# EAGLE design Onion_O2S_mPCIe (EAGLE 9.6.2)
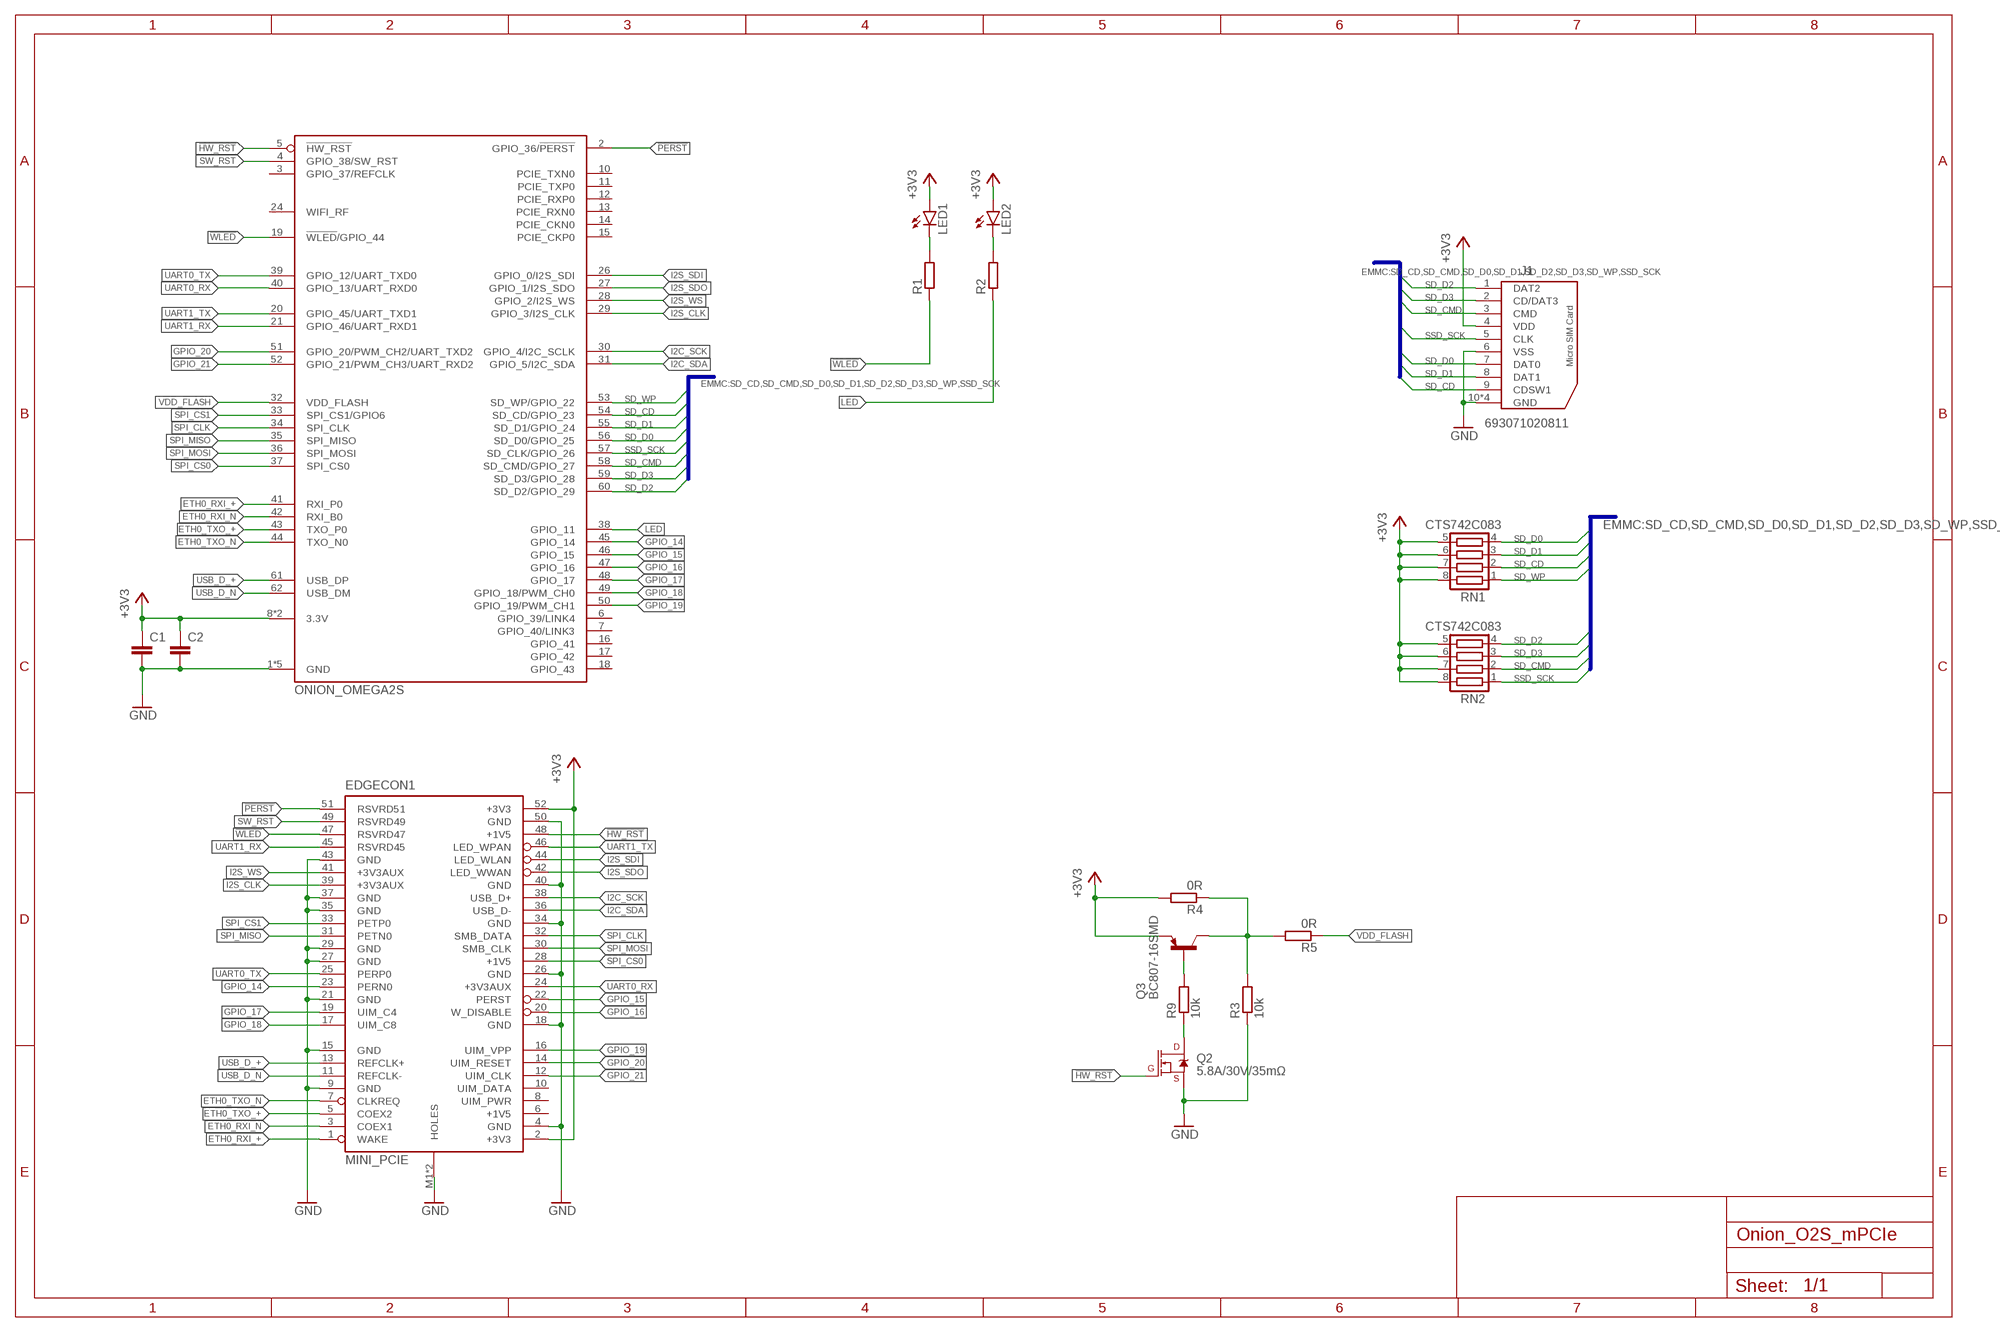
[diagram p0: schematic, sheet 1]

## Parts
C1  C-EUC0603  [C0603]
C2  C-EUC0603  [C0603]
EDGECON1  MINI_PCIE  [MINI_PCIE]
J1  693071020811  [693071020811]
LED1  LEDCHIPLED_0603  [CHIPLED_0603]
LED2  LEDCHIPLED_0603  [CHIPLED_0603]
Q2  5.8A/30V/35mΩ  MOSFET-NCH-AO3404A  [SOT23-3]
Q3  BC807-16SMD  [SOT23-BEC]
R1  R-EU_R0603  [R0603]
R2  R-EU_R0603  [R0603]
R3  10k  R-EU_R0603  [R0603]
R4  0R  R-EU_R0603  [R0603]
R5  0R  R-EU_R0603  [R0603]
R9  10k  R-EU_R0603  [R0603]
RN1  CTS742C083  [CTS742C083]
RN2  CTS742C083  [CTS742C083]
U1  ONION_OMEGA2S  [ONION_OMEGA2S]

## Nets
!HW_RST: EDGECON1.48(+1V5) Q2.1(G) U1.5(!HW_RST)
!PERST: EDGECON1.51(RSVRD51) U1.2(GPIO_36/!PERST)
!WLED: EDGECON1.47(RSVRD47) R1.1 U1.19(!WLED!/GPIO_44)
+3V3: C1.1 C2.1 EDGECON1.2(+3V3) EDGECON1.52(+3V3) J1.4(VDD) LED1.A LED2.A Q3.E R4.2 RN1.5 RN1.6 RN1.7 RN1.8 RN2.5 RN2.6 RN2.7 RN2.8 U1.8(3.3V) U1.9(3.3V)
ETH0_RXI_+ [LAN_100R]: EDGECON1.1(WAKE) U1.41(RXI_P0)
ETH0_RXI_N [LAN_100R]: EDGECON1.3(COEX1) U1.42(RXI_B0)
ETH0_TXO_+ [LAN_100R]: EDGECON1.5(COEX2) U1.43(TXO_P0)
ETH0_TXO_N [LAN_100R]: EDGECON1.7(CLKREQ) U1.44(TXO_N0)
GND: C1.2 C2.2 EDGECON1.4(GND) EDGECON1.9(GND) EDGECON1.15(GND) EDGECON1.18(GND) EDGECON1.21(GND) EDGECON1.26(GND) EDGECON1.27(GND) EDGECON1.29(GND) EDGECON1.34(GND) EDGECON1.35(GND) EDGECON1.37(GND) EDGECON1.40(GND) EDGECON1.43(GND) EDGECON1.50(GND) EDGECON1.M1(HOLES) EDGECON1.M2(HOLES) J1.6(VSS) J1.10(GND) J1.11(GND) J1.12(GND) J1.13(GND) Q2.2(S) R3.1 U1.1(GND) U1.22(GND) U1.23(GND) U1.25(GND) U1.63(GND)
GPIO_14: EDGECON1.23(PERN0) U1.45(GPIO_14)
GPIO_15: EDGECON1.22(PERST) U1.46(GPIO_15)
GPIO_16: EDGECON1.20(W_DISABLE) U1.47(GPIO_16)
GPIO_17: EDGECON1.19(UIM_C4) U1.48(GPIO_17)
GPIO_18: EDGECON1.17(UIM_C8) U1.49(GPIO_18/PWM_CH0)
GPIO_19: EDGECON1.16(UIM_VPP) U1.50(GPIO_19/PWM_CH1)
GPIO_20: EDGECON1.14(UIM_RESET) U1.51(GPIO_20/PWM_CH2/UART_TXD2)
GPIO_21: EDGECON1.12(UIM_CLK) U1.52(GPIO_21/PWM_CH3/UART_RXD2)
I2C_SCK: EDGECON1.38(USB_D+) U1.30(GPIO_4/I2C_SCLK)
I2C_SDA: EDGECON1.36(USB_D-) U1.31(GPIO_5/I2C_SDA)
I2S_CLK: EDGECON1.39(+3V3AUX) U1.29(GPIO_3/I2S_CLK)
I2S_SDI: EDGECON1.44(LED_WLAN) U1.26(GPIO_0/I2S_SDI)
I2S_SDO: EDGECON1.42(LED_WWAN) U1.27(GPIO_1/I2S_SDO)
I2S_WS: EDGECON1.41(+3V3AUX) U1.28(GPIO_2/I2S_WS)
LED: R2.1 U1.38(GPIO_11)
N$1: LED1.C R1.2
N$2: Q3.B R9.2
N$3: Q2.3(D) R9.1
N$4: Q3.C R3.2 R4.1 R5.2
N$7: LED2.C R2.2
SD_CD: J1.9(CDSW1) RN1.2 U1.54(SD_CD/GPIO_23)
SD_CMD: J1.3(CMD) RN2.2 U1.58(SD_CMD/GPIO_27)
SD_D0: J1.7(DAT0) RN1.4 U1.56(SD_D0/GPIO_25)
SD_D1: J1.8(DAT1) RN1.3 U1.55(SD_D1/GPIO_24)
SD_D2: J1.1(DAT2) RN2.4 U1.60(SD_D2/GPIO_29)
SD_D3: J1.2(CD/DAT3) RN2.3 U1.59(SD_D3/GPIO_28)
SD_WP: RN1.1 U1.53(SD_WP/GPIO_22)
SPI_CLK: EDGECON1.32(SMB_DATA) U1.34(SPI_CLK)
SPI_CS0: EDGECON1.28(+1V5) U1.37(SPI_CS0)
SPI_CS1: EDGECON1.33(PETP0) U1.33(SPI_CS1/GPIO6)
SPI_MISO: EDGECON1.31(PETN0) U1.35(SPI_MISO)
SPI_MOSI: EDGECON1.30(SMB_CLK) U1.36(SPI_MOSI)
SSD_SCK: J1.5(CLK) RN2.1 U1.57(SD_CLK/GPIO_26)
SW_RST: EDGECON1.49(RSVRD49) U1.4(GPIO_38/SW_RST)
UART0_RX: EDGECON1.24(+3V3AUX) U1.40(GPIO_13/UART_RXD0)
UART0_TX: EDGECON1.25(PERP0) U1.39(GPIO_12/UART_TXD0)
UART1_RX: EDGECON1.45(RSVRD45) U1.21(GPIO_46/UART_RXD1)
UART1_TX: EDGECON1.46(LED_WPAN) U1.20(GPIO_45/UART_TXD1)
USB_D_+ [USB_90R]: EDGECON1.13(REFCLK+) U1.61(USB_DP)
USB_D_N [USB_90R]: EDGECON1.11(REFCLK-) U1.62(USB_DM)
VDD_FLASH: R5.1 U1.32(VDD_FLASH)
Unconnected: EDGECON1.8(UIM_PWR) EDGECON1.10(UIM_DATA) U1.3(GPIO_37/REFCLK) U1.6(GPIO_39/LINK4) U1.7(GPIO_40/LINK3) U1.10(PCIE_TXN0) U1.11(PCIE_TXP0) U1.12(PCIE_RXP0) U1.13(PCIE_RXN0) U1.14(PCIE_CKN0) U1.15(PCIE_CKP0) U1.16(GPIO_41) U1.17(GPIO_42) U1.18(GPIO_43) U1.24(WIFI_RF)

## Buses
EMMC:SD_CD,SD_CMD,SD_D0,SD_D1,SD_D2,SD_D3,SD_WP,SSD_SCK

## Power pins joined to a net without a drawn wire
+1V5: EDGECON1.6(+1V5)

## Library data of the parts
C1 C2 = rcl:C-EU: CAPACITOR, European symbol; SPICEPREFIX: C
EDGECON1 = Eigene-Rietig:MINI_PCIE
J1 = Wurth_Connectors_WR-CRD:693071020811: WR-CRD Micro SD Card Connector Push & Push 8 pins KIND PROPERTIES Quality Class 10 000 Mating cycles Gender Socket Type Push & Push General Information Operating Temperature -25 up to +85 °C; -40 up to +85 °C Compliance RoHS Electrical Properties Working Voltage 30 V (AC); 100 V (AC) Withstanding Voltage 500 V (AC) Contact Resistance 100 mΩ Contact Resistance 500 mΩ Material Properties Insulator Material LCP Insulator Flammability Rating UL94 V-0 Insulator Color Black Color Black Cover Material Stainless Steel Contact Material Copper Alloy Contact Plating 1 u' on contact area; Selective Gold Contact Type Stamped <hhttps://www.we-online.com/components/media/o32845v209%20Family_ConCRD_693071010811.jpg> Details see: www.we-online.com/en/components/products/CRD_SD_MICRO_PUSH_AND_PULL_8_PINS Updated by Ella Wu 2020-04-15 2020(C) Wurth Elektronik; DATASHEET-URL: https://www.we-online.com/redexpert/spec/693071020811?ae; GERDER: Socket; IR: 0.5A; MOUNT: SMT; PART-NUMBER: 693071020811; PINS: 8; TYPE: Push & Push; WORKING-VOLTAGE: 30V(AC)
LED1 LED2 = led:LED: LED OSRAM: - CHIPLED LG R971, LG N971, LY N971, LG Q971, LY Q971, LO R971, LY R971 LH N974, LH R974 LS Q976, LO Q976, LY Q976 LO Q996 - Hyper CHIPLED LW Q18S LB Q993, LB Q99A, LB R99A - SideLED LS A670, LO A670, LY A670, LG A670, LP A670 LB A673, LV A673, LT A673, LW A673 LH A674 LY A675 LS A676, LA A676, LO A676, LY A676, LW A676 LS A679, LY A679, LG A679 - Hyper Micro SIDELED® LS Y876, LA Y876, LO Y876, LY Y876 LT Y87S - SmartLED LW L88C, LW L88S LB L89C, LB L89S, LG L890 LS L89K, LO L89K, LY L89K LS L896, LA L896, LO L896, LY L896 - TOPLED LS T670, LO T670, LY T670, LG T670, LP T670 LSG T670, LSP T670, LSY T670, LOP T670, LYG T670 LG T671, LOG T671, LSG T671 LB T673, LV T673, LT T673, LW T673 LH T674 LS T676, LA T676, LO T676, LY T676, LB T676, LH T676, LSB T676, LW T676 LB T67C, LV T67C, LT T67C, LS T67K, LO T67K, LY T67K, LW E67C LS E67B, LA E67B, LO E67B, LY E67B, LB E67C, LV E67C, LT E67C LW T67C LS T679, LY T679, LG T679 LS T770, LO T770, LY T770, LG T770, LP T770 LB T773, LV T773, LT T773, LW T773 LH T774 LS E675, LA E675, LY E675, LS T675 LS T776, LA T776, LO T776, LY T776, LB T776 LHGB T686 LT T68C, LB T68C - Hyper Mini TOPLED® LB M676 - Mini TOPLED Santana® LG M470 LS M47K, LO M47K, LY M47K Source: http://www.osram.convergy.de LUXEON: - LUMILED® LXK2-PW12-R00, LXK2-PW12-S00, LXK2-PW14-U00, LXK2-PW14-V00 LXK2-PM12-R00, LXK2-PM12-S00, LXK2-PM14-U00 LXK2-PE12-Q00, LXK2-PE12-R00, LXK2-PE12-S00, LXK2-PE14-T00, LXK2-PE14-U00 LXK2-PB12-K00, LXK2-PB12-L00, LXK2-PB12-M00, LXK2-PB14-N00, LXK2-PB14-P00, LXK2-PB14-Q00 LXK2-PR12-L00, LXK2-PR12-M00, LXK2-PR14-Q00, LXK2-PR14-R00 LXK2-PD12-Q00, LXK2-PD12-R00, LXK2-PD12-S00 LXK2-PH12-R00, LXK2-PH12-S00 LXK2-PL12-P00, LXK2-PL12-Q00, LXK2-PL12-R00 Source: www.luxeon.com KINGBRIGHT: KA-3528ASYC Source: www.kingbright.com
Q2 = SparkFun-DiscreteSemi:MOSFET-NCH: N-channel MOSFETs Voltage controlled devices that allow control of high current outputs. SparkFun Products: SparkFun OpenScale <https://www.sparkfun.com/products/13261> SparkFun Digital Sandbox <https://www.sparkfun.com/products/12651> SparkFun Monster Moto Shield <https://www.sparkfun.com/products/10182> SparkFun MOSFET Power Controller <https://www.sparkfun.com/products/11214>; PROD_ID: TRANS-12988
Q3 = transistor-pnp:BC807*: PNP Transistror
R1-R5 R9 = rcl:R-EU_: RESISTOR, European symbol; SPICEPREFIX: R
RN1 RN2 = resistor-net:CTS742C083: Chip Resistor Array 4 Single Resistor Source: http://www.ctscorp.com/components/Datasheets/CTSChipArrayDs.pdf; OC_FARNELL: unknown; OC_NEWARK: unknown
U1 = Eigene-Rietig:ONION_OMEGA2S

## Net classes
0 default: clearance 0.1 mm
1 USB_90R: width 0.237 mm, clearance 0.15 mm
2 LAN_100R: width 0.178 mm, clearance 0.15 mm

## Board
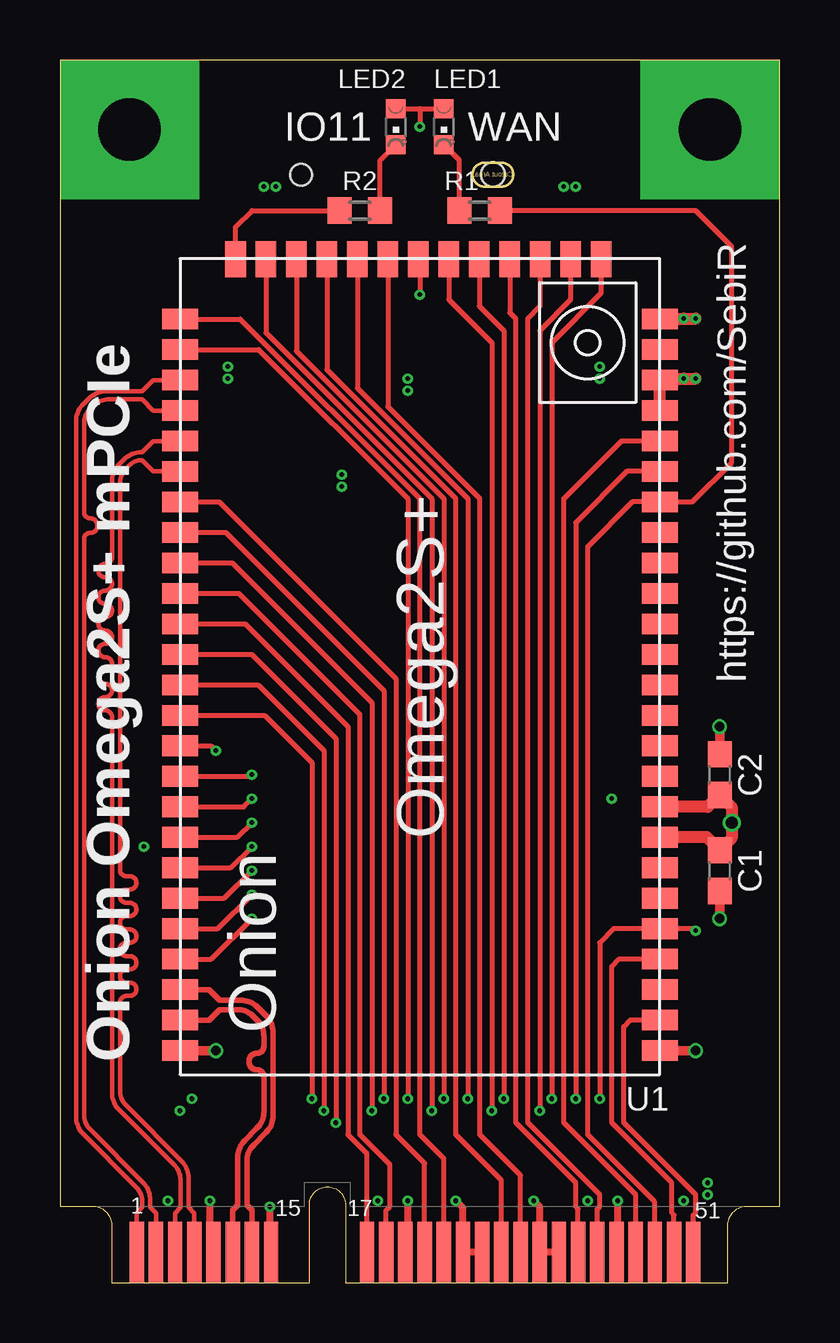
[diagram p1: board, top side]
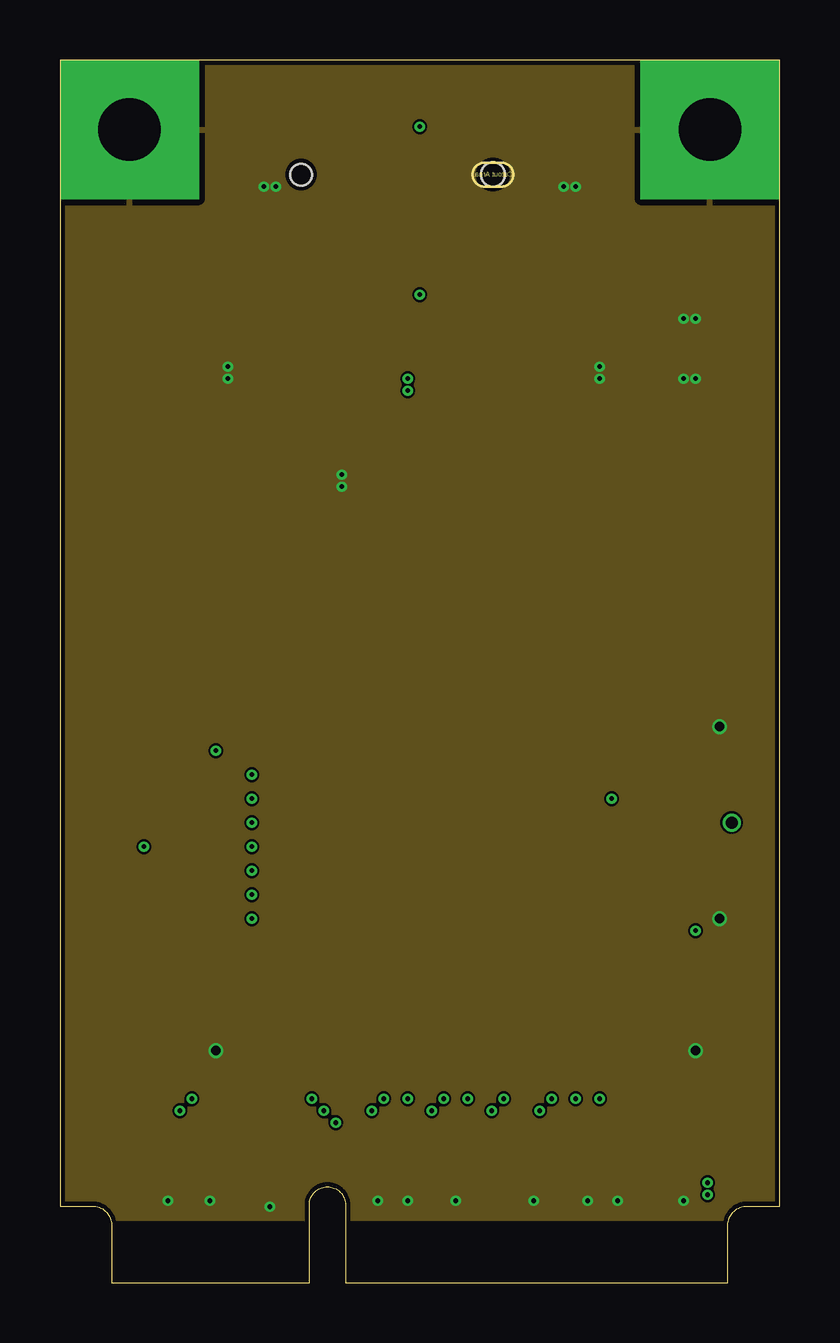
[diagram p2: board, inner layer GND]
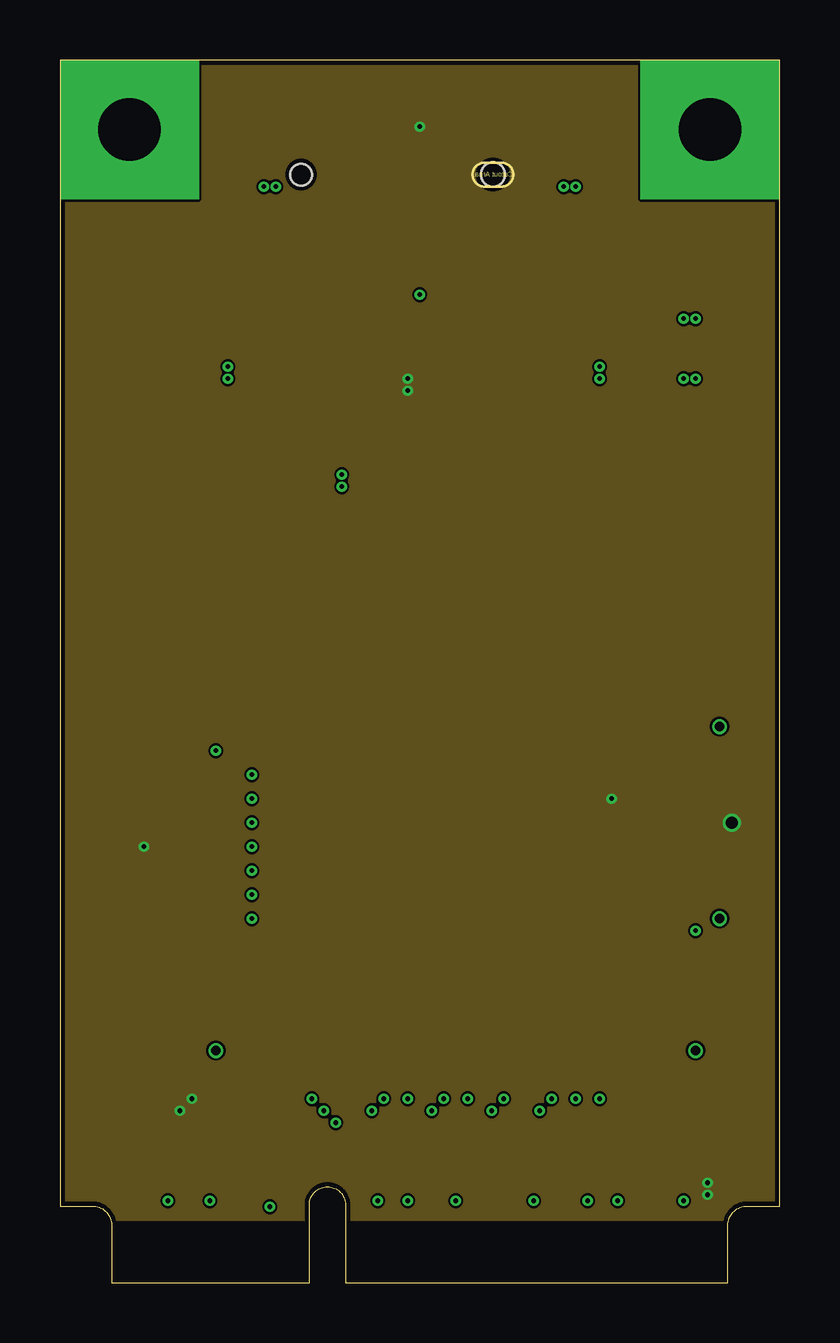
[diagram p3: board, inner layer V+]
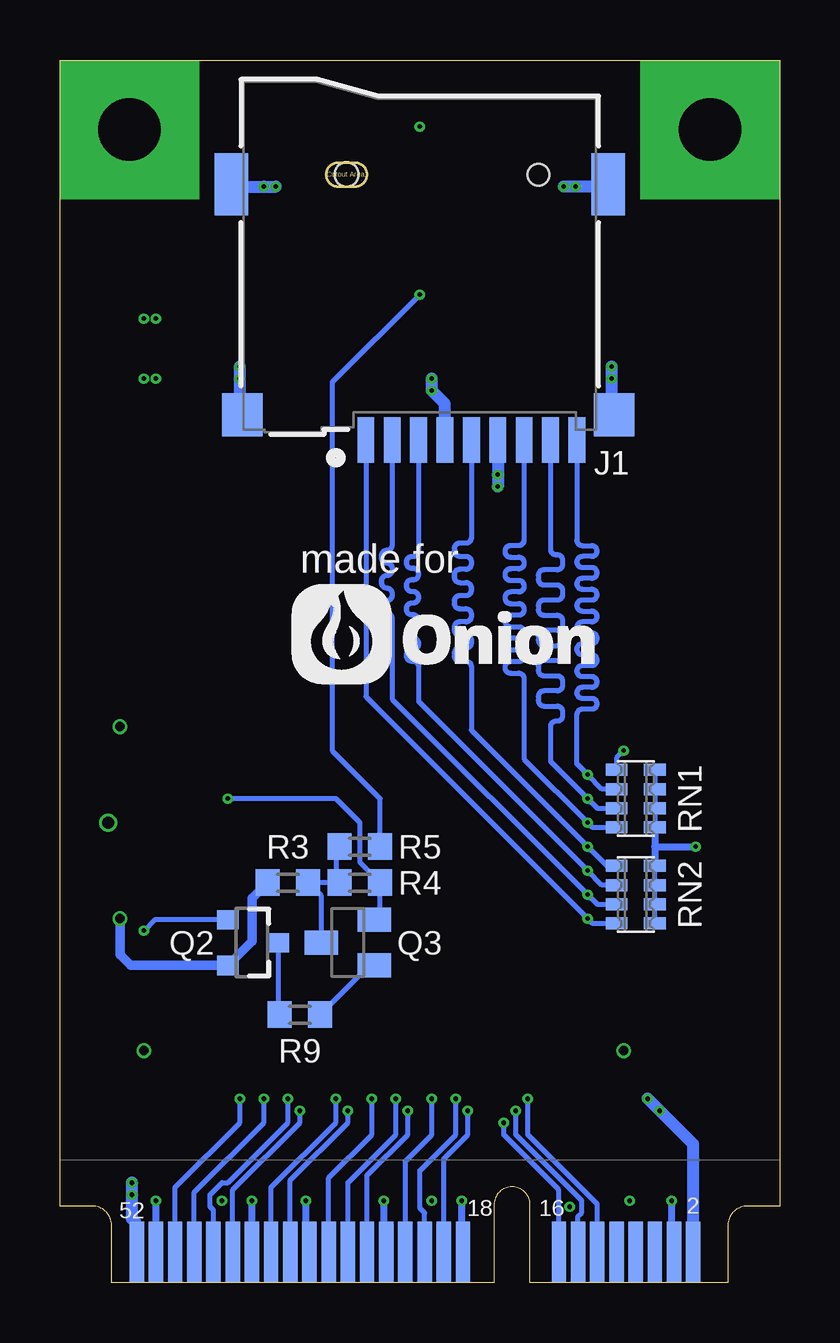
[diagram p4: board, bottom side, seen from below]

Size 30 x 50.95 mm. Coordinates in mm from the lower left corner, seen from the top.
Copper layers (1+2*15+16): Top 0.035mm / dielectric 0.2mm / GND 0.0175mm / dielectric 1.065mm / V+ 0.0175mm / dielectric 0.2mm / Bottom 0.035mm
Design rules "jlcpcb-4layers_seb": minimum track width 0.1mm, minimum drill 0.2mm, track to track 0.1mm, track to pad 0.1mm, pad to pad 0.1mm, via to via 0.1mm, smd to smd 0mil, copper to edge 0.2mm, drill to drill 8mil, minimum pad ring 0.125mm, minimum via ring 0.11mm, stop-mask expansion 2mil, vias tented up to drill 20mil, thermal gap 10mil

### Footprints (pad centres in the part's own frame; a part is rotated, then mirrored left to right if it is on the bottom)
C0603 = smd 1.1 x 1: 1 -0.85,0; 2 0.85,0
MINI_PCIE = smd 0.6 x 2.55: 1 3.2,-1.9; 3 4,-1.9; 5 4.8,-1.9; 7 5.6,-1.9; 9 6.4,-1.9; 11 7.2,-1.9; 13 8,-1.9; 15 8.8,-1.9; 17 12.8,-1.9; 19 13.6,-1.9; 21 14.4,-1.9; 23 15.2,-1.9; 25 16,-1.9; 27 16.8,-1.9; 29 17.6,-1.9; 31 18.4,-1.9; 33 19.2,-1.9; 35 20,-1.9; 37 20.8,-1.9; 39 21.6,-1.9; 41 22.4,-1.9; 43 23.2,-1.9; 45 24,-1.9; 47 24.8,-1.9; 49 25.6,-1.9; 51 26.4,-1.9 | smd 0.6 x 2.55 bottom: 2 3.6,-1.9; 4 4.4,-1.9; 6 5.2,-1.9; 8 6,-1.9; 10 6.8,-1.9; 12 7.6,-1.9; 14 8.4,-1.9; 16 9.2,-1.9; 18 13.2,-1.9; 20 14,-1.9; 22 14.8,-1.9; 24 15.6,-1.9; 26 16.4,-1.9; 28 17.2,-1.9; 30 18,-1.9; 32 18.8,-1.9; 34 19.6,-1.9; 36 20.4,-1.9; 38 21.2,-1.9; 40 22,-1.9; 42 22.8,-1.9; 44 23.6,-1.9; 46 24.4,-1.9; 48 25.2,-1.9; 50 26,-1.9; 52 26.8,-1.9 | drill 2.6 pad 5.8 square: M1 2.9,44.875; M2 27.1,44.875
693071020811 = smd 0.7 x 1.9: 1 2.25,11.05; 2 1.15,11.05; 3 0.05,11.05; 4 -1.05,11.05; 5 -2.15,11.05; 6 -3.25,11.05; 7 -4.35,11.05; 8 -5.45,11.05; 9 -6.55,11.05 | smd 1.7 x 1.8: 10 -8.1,10; 11 7.4,10 | smd 1.4 x 2.6: 12 -7.85,0.4; 13 7.85,0.4 | hole 0.9: -4.95,0 | hole 1: 3.05,0
CHIPLED_0603 = smd 0.8 x 0.8: A 0,-0.75; C 0,0.75
SOT23-3 = smd 0.8 x 0.9: 1 -0.95,-1; 2 0.95,-1; 3 0,1.1
SOT23-BEC = smd 1 x 1.4: B -0.95,-1.1; C 0,1.1; E 0.95,-1.1
R0603 = smd 1 x 1.1: 1 -0.85,0; 2 0.85,0
CTS742C083 = smd 0.5 x 0.9: 1 -1.2,-0.8; 2 -0.4,-0.8; 3 0.4,-0.8; 4 1.2,-0.8; 5 1.2,0.8; 6 0.4,0.8; 7 -0.4,0.8; 8 -1.2,0.8
ONION_OMEGA2S = smd 0.86 x 1.5: 1 -16,-10; 2 -14.73,-10; 3 -13.46,-10; 4 -12.19,-10; 5 -10.92,-10; 6 -9.65,-10; 7 -8.38,-10; 8 -7.11,-10; 9 -5.84,-10; 10 -4.57,-10; 11 -3.3,-10; 12 -2.03,-10; 13 -0.76,-10; 14 0.51,-10; 15 1.78,-10; 16 3.05,-10; 17 4.32,-10; 18 5.59,-10; 19 6.86,-10; 20 8.13,-10; 21 9.4,-10; 22 10.67,-10; 23 11.94,-10; 24 13.21,-10; 25 14.48,-10; 39 14.48,10; 40 13.21,10; 41 11.94,10; 42 10.67,10; 43 9.4,10; 44 8.13,10; 45 6.86,10; 46 5.59,10; 47 4.32,10; 48 3.05,10; 49 1.78,10; 50 0.51,10; 51 -0.76,10; 52 -2.03,10; 53 -3.3,10; 54 -4.57,10; 55 -5.84,10; 56 -7.11,10; 57 -8.38,10; 58 -9.65,10; 59 -10.92,10; 60 -12.19,10; 61 -13.46,10; 62 -14.73,10; 63 -16,10 | smd 1.5 x 0.86: 26 16.98,-7.56; 27 16.98,-6.29; 28 16.98,-5.02; 29 16.98,-3.75; 30 16.98,-2.48; 31 16.98,-1.21; 32 16.98,0.06; 33 16.98,1.33; 34 16.98,2.6; 35 16.98,3.87; 36 16.98,5.14; 37 16.98,6.41; 38 16.98,7.68

### Placement (x,y rotation side)
C1  27.5,17.18 270 top
C2  27.5,21.18 90 top
EDGECON1  0,3.17 0 top
J1  15,46.17 180 bottom
LED1  16,48.17 180 top
LED2  14,48.17 180 top
Q2  22,14.18 270 bottom
Q3  18,14.18 90 bottom
R1  17.5,44.67 180 top
R2  12.5,44.67 0 top
R3  20.5,16.68 0 bottom
R4  17.5,16.68 0 bottom
R5  17.5,18.18 180 bottom
R9  20,11.18 0 bottom
RN1  6,20.18 270 bottom
RN2  6,16.18 270 bottom
U1  15,25.68 90 top

### Tracks (layer width: path | path; a pad name or v marks a point on that pad's centre or on a via)
!HW_RST  (via drill 0.2)
  Top 0.2: v22.5,7.67 22.5,14.18 23.08,14.75 U1.5 26.42,14.75 v26.5,14.68
  Bottom 0.2: EDGECON1.48 25.2,3.97 22.5,6.67 v22.5,7.67 | v26.5,14.68 26.05,15.12 Q2.1
!PERST
  Top 0.2: U1.2 23.77,10.95 23.5,10.68 23.5,6.67 26.5,3.67 26.5,2.92 26.4,2.82 EDGECON1.51
!WLED
  Top 0.2: EDGECON1.47 24.8,3.38 22,6.17 22,30.68 23.86,32.53 U1.19 26.36,32.53 28,34.17 28,43.17 26.5,44.67 R1.1
+3V3  (via drill 0.2, 0.5)
  Top 0.2: LED2.A 15,48.92 | 15,48.92 LED1.A | 15,48.92 v15,48.17
  Top 0.5: U1.9 27.01,19.84 C2.1 28,19.82 v28,19.18 28,18.52 C1.1 26.96,18.57 U1.8
  Bottom 0.2: RN1.8 RN1.7 RN1.6 RN1.5 | RN2.5 RN2.6 RN2.7 RN2.8 | Q3.E 16.65,15.38 R4.2 17.5,17.52 17.5,19.18 18.5,20.18 v23,20.18
  Bottom 0.3: RN1.5 5.2,18.18 | 5.2,18.18 RN2.8 | 5.2,18.18 v3.5,18.18
  Bottom 0.5: 14,35.17 J1.4 13.95,36.62 v14.5,37.17 v14.5,37.67 | EDGECON1.52 26.85,1.32 26.85,2.5 27,2.65 v27,3.67 v27,4.17 | EDGECON1.2 3.6,5.78 v5,7.17 v5.5,7.67
  pour V+: 30,2.67 0,2.67 0,51.17 30,51.17
ETH0_RXI_+
  Top 0.178: U1.41 3.89,37.61 3.42,37.14 1.92,37.14 arc45 1.21,36.85 0.96,36.6 arc45 0.67,35.9 0.67,6.92 arc45 0.96,6.21 3.14,4.03 arc-45 3.44,3.32 3.44,3.14 3.2,2.91 EDGECON1.1
ETH0_RXI_N
  Top 0.178: U1.42 3.89,36.34 3.42,36.82 2.06,36.82 arc45 1.35,36.52 1.29,36.47 arc45 1,35.76 1,32.12 arc90 1.28,31.85 arc-90 1.55,31.57 1.55,31.53 arc-90 1.28,31.25 arc90 1,30.98 1,7.05 arc45 1.29,6.35 3.47,4.17 arc-45 3.76,3.46 3.76,3.14 4,2.91 EDGECON1.3
ETH0_TXO_+
  Top 0.178: U1.43 3.89,35.07 3.42,34.6 3.38,34.6 arc45 2.67,34.31 2.46,34.1 arc45 2.17,33.4 2.17,30.23 arc-90 1.9,29.95 1.88,29.95 arc90 1.6,29.68 1.6,29.67 arc90 1.88,29.4 1.9,29.4 arc-90 2.17,29.12 2.17,29.12 arc-90 1.9,28.84 1.88,28.84 arc90 1.6,28.57 1.6,28.56 arc90 1.88,28.29 1.9,28.29 arc-90 2.17,28.01 2.17,28.01 arc-90 1.9,27.73 1.88,27.73 arc90 1.6,27.46 1.6,27.46 arc90 1.88,27.18 1.9,27.18 arc-90 2.17,26.9 2.17,26.9 arc-90 1.9,26.62 1.88,26.62 arc90 1.6,26.35 1.6,26.35 arc90 1.88,26.07 1.9,26.07 arc-90 2.17,25.79 2.17,25.79 arc-90 1.9,25.52 1.88,25.52 arc90 1.6,25.24 1.6,25.24 arc90 1.88,24.96 1.9,24.96 arc-90 2.17,24.68 2.17,24.68 arc-90 1.9,24.41 1.88,24.41 arc90 1.6,24.13 1.6,24.13 arc90 1.88,23.85 1.9,23.85 arc-90 2.17,23.57 2.17,7.92 arc45 2.46,7.21 4.74,4.93 arc-45 5.04,4.22 5.04,3.14 4.8,2.91 EDGECON1.5
ETH0_TXO_N
  Top 0.178: U1.44 3.89,33.8 3.42,34.28 arc45 2.87,34.05 2.79,33.97 arc45 2.5,33.26 2.5,17.22 arc90 2.78,16.94 2.91,16.94 arc-90 3.19,16.66 3.19,16.66 arc-90 2.91,16.39 2.78,16.39 arc90 2.5,16.11 2.5,16.11 arc90 2.78,15.83 2.91,15.83 arc-90 3.19,15.56 3.19,15.55 arc-90 2.91,15.28 2.78,15.28 arc90 2.5,15 2.5,15 arc90 2.78,14.72 2.91,14.72 arc-90 3.19,14.45 3.19,14.45 arc-90 2.91,14.17 2.78,14.17 arc90 2.5,13.89 2.5,13.89 arc90 2.78,13.61 2.91,13.61 arc-90 3.19,13.34 3.19,13.34 arc-90 2.91,13.06 2.78,13.06 arc90 2.5,12.78 2.5,12.78 arc90 2.78,12.51 2.91,12.51 arc-90 3.19,12.23 3.19,12.23 arc-90 2.91,11.95 2.78,11.95 arc90 2.5,11.68 2.5,8.05 arc45 2.79,7.35 5.07,5.07 arc-45 5.36,4.36 5.36,3.14 5.6,2.91 EDGECON1.7
GND  (via drill 0.2, 0.4)
  Top 0.3: EDGECON1.9 6.25,1.42 v6.25,3.42 | EDGECON1.15 8.75,1.32 v8.75,3.17 | EDGECON1.21 14.5,1.37 v14.5,3.42 | v16.5,3.42 16.8,3.12 EDGECON1.27 EDGECON1.29 | v19.75,3.42 20,3.17 EDGECON1.35 EDGECON1.37 | EDGECON1.43 23.25,1.32 v23.25,3.42
  Top 0.4: U1.1 v26.5,9.68 | U1.63 v6.5,9.68 | C2.2 v27.5,23.18 | C1.2 v27.5,15.18
  Top 0.5: U1.22 U1.23 25.06,37.67 v26,37.67 v26.5,37.67 | U1.25 25.02,40.17 v26,40.17 v26.5,40.17
  Bottom 0.2: Q2.2 22.95,13.23
  Bottom 0.3: EDGECON1.18 13.25,1.32 v13.25,3.42 | EDGECON1.26 16.5,1.37 v16.5,3.42 | EDGECON1.34 19.75,1.42 v19.75,3.42 | EDGECON1.40 v22,3.42 | EDGECON1.50 v26,3.42 | EDGECON1.4 4.5,1.37 v4.5,3.42
  Bottom 0.4: R3.1 22,16.02 22,14.23 Q2.2 27.05,13.23 27.5,13.68 v27.5,15.18
  Bottom 0.5: J1.13 22.75,45.67 v21.5,45.67 v21,45.67 | J1.12 7.25,45.67 v8.5,45.67 v9,45.67 | J1.10 7,36.27 v7,37.67 v7,38.17 | J1.11 22.5,36.27 v22.5,37.67 v22.5,38.17 | J1.6 v11.75,33.67 v11.75,33.17
  pour GND: 30,2.67 0,2.67 0,51.17 30,51.17
GPIO_14
  Top 0.2: EDGECON1.23 15.2,4.97 14,6.17 14,25.18 6.64,32.53 U1.45
GPIO_15  (via drill 0.2)
  Top 0.2: U1.46 6.91,31.27 13.5,24.68 v13.5,7.67
  Bottom 0.2: EDGECON1.22 14.8,2.91 15,3.11 15,4.67 13.5,6.17 v13.5,7.67
GPIO_16  (via drill 0.2)
  Top 0.2: U1.47 7.18,30 13,24.18 v13,7.17
  Bottom 0.2: EDGECON1.20 14,5.17 13,6.17 v13,7.17
GPIO_17
  Top 0.2: U1.48 7.45,28.73 12.5,23.68 12.5,6.17 13.75,4.92 13.75,3.17 13.6,3.02 EDGECON1.19
GPIO_18
  Top 0.2: EDGECON1.17 12.8,5.38 12,6.17 12,23.18 7.72,27.46 U1.49
GPIO_19  (via drill 0.2)
  Top 0.2: v11.5,6.67 11.5,22.68 7.99,26.19 U1.50
  Bottom 0.2: EDGECON1.16 9.2,3.88 11.5,6.17 v11.5,6.67
GPIO_20  (via drill 0.2)
  Top 0.2: v11,7.17 11,22.18 8.26,24.91 U1.51
  Bottom 0.2: v11,7.17 11,6.17 8.25,3.42 8.25,2.92 8.4,2.77 EDGECON1.14
GPIO_21  (via drill 0.2)
  Top 0.2: v10.5,7.67 10.5,21.68 8.53,23.64 U1.52
  Bottom 0.2: EDGECON1.12 7.6,3.27 10.5,6.17 v10.5,7.67
I2C_SCK  (via drill 0.2)
  Top 0.2: U1.30 17.48,40.7 18.5,39.67 v18.5,7.67
  Bottom 0.2: EDGECON1.38 21.2,3.97 18.5,6.67 v18.5,7.67
I2C_SDA  (via drill 0.2)
  Top 0.2: U1.31 16.21,40.96 18,39.17 v18,7.17
  Bottom 0.2: EDGECON1.36 20.4,4.28 18,6.67 v18,7.17
I2S_CLK
  Top 0.2: U1.29 18.75,40.42 19,40.17 19,6.67 21.5,4.17 21.5,3.17 21.6,3.07 EDGECON1.39
I2S_SDI  (via drill 0.2)
  Top 0.2: U1.26 22.56,41.23 20.5,39.17 v20.5,7.67
  Bottom 0.2: v20.5,7.67 20.5,6.67 23,4.17 23.25,4.17 23.75,3.67 23.75,3.17 23.6,3.02 EDGECON1.44
I2S_SDO  (via drill 0.2)
  Top 0.2: U1.27 21.29,40.96 20,39.67 v20,7.17
  Bottom 0.2: EDGECON1.42 22.8,3.88 20,6.67 v20,7.17
I2S_WS
  Top 0.2: U1.28 20.02,40.7 19.5,40.17 19.5,6.67 22.5,3.67 22.5,3.17 22.4,3.07 EDGECON1.41
LED
  Top 0.2: U1.38 7.32,43.99 8,44.67 R2.1
N$1
  Top 0.2: R1.2 16.65,46.77 LED1.C
N$2
  Bottom 0.2: Q3.B 17.1,13.23 R9.2
N$3
  Bottom 0.2: Q2.3 20.9,11.23 R9.1
N$4
  Bottom 0.2: Q3.C 19.1,16.12 19.57,16.6 | 19.57,16.6 R3.2 | R4.1 18.5,16.68 | 18.5,16.68 19.5,16.68 19.57,16.6 | R5.2 18.5,18.02 18.5,16.68
N$7
  Top 0.2: R2.2 13.35,46.77 LED2.C
SD_CD  (via drill 0.2)
  Top 0.2: U1.54 7.93,21.11 v8,21.18
  Bottom 0.2: J1.9 8.45,30.94 arc-90 8.22,30.72 7.84,30.72 arc90 7.61,30.49 7.61,30.49 arc90 7.84,30.26 8.22,30.26 arc-90 8.45,30.04 8.45,30.03 arc-90 8.22,29.81 7.84,29.81 arc90 7.61,29.58 7.61,29.58 arc90 7.84,29.35 8.22,29.35 arc-90 8.45,29.13 8.45,29.12 arc-90 8.22,28.9 7.84,28.9 arc90 7.61,28.67 7.61,28.67 arc90 7.84,28.45 8.22,28.45 arc-90 8.45,28.22 8.45,28.21 arc-90 8.22,27.99 7.84,27.99 arc90 7.61,27.77 7.61,27.76 arc90 7.84,27.54 8.22,27.54 arc-90 8.45,27.31 8.45,27.31 arc-90 8.22,27.08 7.84,27.08 arc90 7.61,26.86 7.61,26.85 arc90 7.84,26.63 8.22,26.63 arc-90 8.45,26.4 8.45,26.4 arc-90 8.22,26.17 7.84,26.17 arc90 7.61,25.95 7.61,25.94 arc90 7.84,25.72 8.22,25.72 arc-90 8.45,25.49 8.45,25.49 arc-90 8.22,25.26 7.84,25.26 arc90 7.61,25.04 7.61,25.03 arc90 7.84,24.81 8.22,24.81 arc-90 8.45,24.58 8.45,24.58 arc-90 8.22,24.35 7.84,24.35 arc90 7.61,24.13 7.61,24.12 arc90 7.84,23.9 8.22,23.9 arc-90 8.45,23.68 8.45,21.62 v8,21.18 7.4,20.57 RN1.2
SD_CMD  (via drill 0.2)
  Top 0.2: U1.58 6.85,16.02 v8,17.18
  Bottom 0.2: J1.3 15.05,30.48 arc90 15.28,30.26 15.33,30.26 arc-90 15.56,30.03 15.56,30 arc-90 15.33,29.77 15.28,29.77 arc90 15.05,29.55 15.05,29.52 arc90 15.28,29.29 15.33,29.29 arc-90 15.56,29.07 15.56,29.03 arc-90 15.33,28.81 15.28,28.81 arc90 15.05,28.58 15.05,28.55 arc90 15.28,28.32 15.33,28.32 arc-90 15.56,28.1 15.56,28.06 arc-90 15.33,27.84 15.28,27.84 arc90 15.05,27.61 15.05,27.58 arc90 15.28,27.35 15.33,27.35 arc-90 15.56,27.13 15.56,27.09 arc-90 15.33,26.87 15.28,26.87 arc90 15.05,26.64 15.05,26.61 arc90 15.28,26.38 15.33,26.38 arc-90 15.56,26.16 15.56,26.12 arc-90 15.33,25.9 15.28,25.9 arc90 15.05,25.68 15.05,24.23 v8,17.18 7.4,16.57 RN2.2
SD_D0  (via drill 0.2)
  Top 0.2: U1.56 7.39,18.57 v8,19.18
  Bottom 0.2: J1.7 10.65,30.94 arc90 10.88,30.72 11.22,30.72 arc-90 11.44,30.49 11.44,30.46 arc-90 11.22,30.23 10.88,30.23 arc90 10.65,30.01 10.65,29.98 arc90 10.88,29.75 11.22,29.75 arc-90 11.44,29.53 11.44,29.49 arc-90 11.22,29.27 10.88,29.27 arc90 10.65,29.04 10.65,29.01 arc90 10.88,28.78 11.22,28.78 arc-90 11.44,28.56 11.44,28.53 arc-90 11.22,28.3 10.88,28.3 arc90 10.65,28.07 10.65,28.04 arc90 10.88,27.82 11.22,27.82 arc-90 11.44,27.59 11.44,27.56 arc-90 11.22,27.33 10.88,27.33 arc90 10.65,27.11 10.65,27.07 arc90 10.88,26.85 11.22,26.85 arc-90 11.44,26.62 11.44,26.59 arc-90 11.22,26.37 10.88,26.37 arc90 10.65,26.14 10.65,26.11 arc90 10.88,25.88 11.22,25.88 arc-90 11.44,25.66 11.44,25.62 arc-90 11.22,25.4 10.88,25.4 arc90 10.65,25.18 10.65,21.82 v8,19.18 7.8,18.98 RN1.4
SD_D1  (via drill 0.2)
  Top 0.2: U1.55 7.66,19.84 v8,20.18
  Bottom 0.2: J1.8 9.55,30.56 arc-90 9.32,30.34 9.27,30.34 arc90 9.05,30.11 9.05,29.93 arc90 9.27,29.71 9.83,29.71 arc-90 10.05,29.48 10.05,29.3 arc-90 9.83,29.08 9.27,29.08 arc90 9.05,28.85 9.05,28.67 arc90 9.27,28.45 9.83,28.45 arc-90 10.05,28.22 10.05,28.04 arc-90 9.83,27.82 9.27,27.82 arc90 9.05,27.59 9.05,27.41 arc90 9.27,27.19 9.83,27.19 arc-90 10.05,26.96 10.05,26.78 arc-90 9.83,26.55 9.27,26.55 arc90 9.05,26.33 9.05,26.15 arc90 9.27,25.92 9.83,25.92 arc-90 10.05,25.7 10.05,25.52 arc-90 9.83,25.29 9.27,25.29 arc90 9.05,25.07 9.05,24.89 arc90 9.27,24.66 9.83,24.66 arc-90 10.05,24.44 10.05,24.26 arc-90 9.83,24.03 9.27,24.03 arc90 9.05,23.81 9.05,23.62 arc90 9.27,23.4 9.32,23.4 arc-90 9.55,23.18 9.55,21.73 v8,20.18 7.6,19.78 RN1.3
SD_D2  (via drill 0.2)
  Top 0.2: U1.60 6.31,13.48 v8,15.18
  Bottom 0.2: J1.1 17.25,24.43 v8,15.18 7.8,14.98 RN2.4
SD_D3  (via drill 0.2)
  Top 0.2: U1.59 6.58,14.75 v8,16.18
  Bottom 0.2: J1.2 16.15,30.74 arc90 16.38,30.52 arc-90 16.6,30.29 16.6,30.22 arc-90 16.38,29.99 arc90 16.15,29.77 16.15,29.7 arc90 16.38,29.47 arc-90 16.6,29.25 16.6,29.17 arc-90 16.38,28.95 arc90 16.15,28.72 16.15,28.65 arc90 16.38,28.42 arc-90 16.6,28.2 16.6,28.12 arc-90 16.38,27.9 arc90 16.15,27.68 16.15,24.32 v8,16.18 7.6,15.77 RN2.3
SD_WP  (via drill 0.2)
  Top 0.2: U1.53 6.3,22.38 v6.5,22.18
  Bottom 0.2: v6.5,22.18 6.8,21.88 RN1.1
SPI_CLK  (via drill 0.2)
  Top 0.2: U1.34 12.4,37.27 17,32.67 v17,7.67
  Bottom 0.2: EDGECON1.32 18.8,4.38 17,6.17 v17,7.67
SPI_CS0  (via drill 0.2)
  Top 0.2: U1.37 8.59,39.58 15.5,32.67 v15.5,7.17
  Bottom 0.2: v15.5,7.17 15.5,6.17 17.2,4.47 EDGECON1.28
SPI_CS1
  Top 0.2: U1.33 13.67,36.5 17.5,32.67 17.5,6.17 19.2,4.47 EDGECON1.33
SPI_MISO
  Top 0.2: U1.35 11.13,38.04 16.5,32.67 16.5,6.17 18.4,4.28 EDGECON1.31
SPI_MOSI  (via drill 0.2)
  Top 0.2: U1.36 9.86,38.81 16,32.67 v16,7.67
  Bottom 0.2: EDGECON1.30 18,4.17 16,6.17 v16,7.67
SSD_SCK  (via drill 0.2)
  Top 0.2: U1.57 7.12,17.29 v8,18.18
  Bottom 0.2: J1.5 12.85,31.04 arc90 13.07,30.82 13.33,30.82 arc-90 13.56,30.59 13.56,30.5 arc-90 13.33,30.27 13.07,30.27 arc90 12.85,30.05 12.85,29.95 arc90 13.07,29.73 13.33,29.73 arc-90 13.56,29.5 13.56,29.4 arc-90 13.33,29.18 13.07,29.18 arc90 12.85,28.95 12.85,28.86 arc90 13.07,28.63 13.33,28.63 arc-90 13.56,28.41 13.56,28.31 arc-90 13.33,28.09 13.07,28.09 arc90 12.85,27.86 12.85,27.77 arc90 13.07,27.54 13.33,27.54 arc-90 13.56,27.32 13.56,27.22 arc-90 13.33,26.99 13.07,26.99 arc90 12.85,26.77 12.85,26.67 arc90 13.07,26.45 13.33,26.45 arc-90 13.56,26.22 13.56,26.12 arc-90 13.33,25.9 13.07,25.9 arc90 12.85,25.68 12.85,23.03 v8,18.18 7.2,17.38 RN2.1
SW_RST
  Top 0.2: U1.4 23.31,13.48 23,13.18 23,6.67 25.5,4.17 25.5,2.92 25.6,2.82 EDGECON1.49
UART0_RX  (via drill 0.2)
  Top 0.2: U1.40 8.29,38.88 14.5,32.67 v14.5,7.67
  Bottom 0.2: EDGECON1.24 15.6,5.07 14.5,6.17 v14.5,7.67
UART0_TX
  Top 0.2: U1.39 7.52,40.15 15,32.67 15,6.17 16,5.17 EDGECON1.25
UART1_RX
  Top 0.2: U1.21 23.4,35.07 21,32.67 21,6.67 24,3.67 EDGECON1.45
UART1_TX  (via drill 0.2)
  Top 0.2: U1.20 23.63,33.8 21.5,31.68 v21.5,7.67
  Bottom 0.2: EDGECON1.46 24.4,3.77 21.5,6.67 v21.5,7.67
USB_D_+
  Top 0.237: EDGECON1.13 8,3.02 7.79,3.23 7.79,5.05 arc-45 8.09,5.76 8.59,6.27 arc45 8.89,6.98 8.89,10.42 arc45 8.59,11.13 8.24,11.48 arc45 7.54,11.77 6.67,11.77 6.22,12.21 U1.61
USB_D_N
  Top 0.237: EDGECON1.11 7.2,3.02 7.41,3.23 7.41,5.21 arc-45 7.7,5.92 8.21,6.43 arc45 8.5,7.14 8.5,8.57 arc90 8.19,8.88 arc-90 7.89,9.19 7.89,9.25 arc-90 8.19,9.56 arc90 8.5,9.86 8.5,10.26 arc45 8.21,10.97 8.08,11.09 arc45 7.37,11.39 6.67,11.39 6.22,10.95 U1.62
VDD_FLASH  (via drill 0.2)
  Top 0.2: U1.32 15,42.59 v15,41.17
  Bottom 0.2: v15,41.17 18.65,37.52 18.65,22.18 16.65,20.18 R5.1

### Text on the board
tPlace: IO11 | WAN | https://github.com/SebiR | Onion Omega2S+ mPCIe | 1 | 15 | 17 | 51
bPlace: made for | 2 | 16 | 18 | 52